# Altium schematic sheet Onboard interfaces.SchDoc
size A4; SheetNumber: 7; SheetTotal: 7
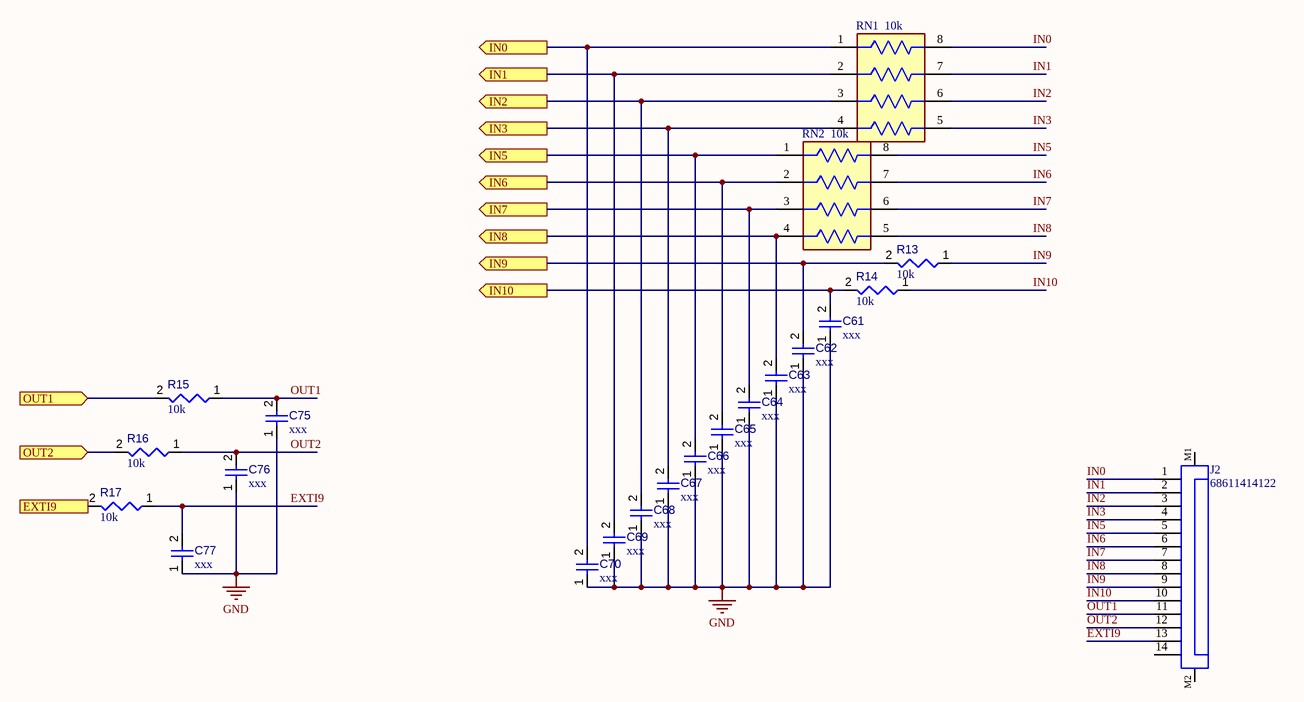
[diagram p0: Onboard interfaces.SchDoc]

## Parts
C61  value xxx  [CAPC0603(1608)100_L]  (hidden comment: Capacitor 470nF +/-20% 25V 0603)
C62  value xxx  [CAPC0603(1608)100_L]  (hidden comment: Capacitor 470nF +/-20% 25V 0603)
C63  value xxx  [CAPC0603(1608)100_L]  (hidden comment: Capacitor 470nF +/-20% 25V 0603)
C64  value xxx  [CAPC0603(1608)100_L]  (hidden comment: Capacitor 470nF +/-20% 25V 0603)
C65  value xxx  [CAPC0603(1608)100_L]  (hidden comment: Capacitor 470nF +/-20% 25V 0603)
C66  value xxx  [CAPC0603(1608)100_L]  (hidden comment: Capacitor 470nF +/-20% 25V 0603)
C67  value xxx  [CAPC0603(1608)100_L]  (hidden comment: Capacitor 470nF +/-20% 25V 0603)
C68  value xxx  [CAPC0603(1608)100_L]  (hidden comment: Capacitor 470nF +/-20% 25V 0603)
C69  value xxx  [CAPC0603(1608)100_L]  (hidden comment: Capacitor 470nF +/-20% 25V 0603)
C70  value xxx  [CAPC0603(1608)100_L]  (hidden comment: Capacitor 470nF +/-20% 25V 0603)
C75  value xxx  [CAPC0603(1608)100_L]  (hidden comment: Capacitor 470nF +/-20% 25V 0603)
C76  value xxx  [CAPC0603(1608)100_L]  (hidden comment: Capacitor 470nF +/-20% 25V 0603)
C77  value xxx  [CAPC0603(1608)100_L]  (hidden comment: Capacitor 470nF +/-20% 25V 0603)
J2  68611414122  [68611414122]
R13  value 10k  [RESC0603(1608)_L]  (hidden comment: 120R3J)
R14  value 10k  [RESC0603(1608)_L]  (hidden comment: 120R3J)
R15  value 10k  [RESC0603(1608)_L]  (hidden comment: 120R3J)
R16  value 10k  [RESC0603(1608)_L]  (hidden comment: 120R3J)
R17  value 10k  [RESC0603(1608)_L]  (hidden comment: 120R3J)
RN1  10k  [FP-YC164-MFG]
RN2  10k  [FP-YC164-MFG]

## Ports
EXTI9 (out), IN0 (out), IN1 (out), IN2 (out), IN3 (out), IN5 (out), IN6 (out), IN7 (out), IN8 (out), IN9 (out), IN10 (out), OUT1 (in), OUT2 (in)

## Nets
GND: C61.1 C62.1 C63.1 C64.1 C65.1 C66.1 C67.1 C68.1 C69.1 C70.1 C75.1 C76.1 C77.1
EXTI9: C77.2 J2.13 R17.1
EXTI9: R17.2 ; port EXTI9  [a separate net that carries the same name]
IN0: C70.2 RN1.1 ; port IN0
IN0: J2.1 RN1.8  [a separate net that carries the same name]
IN1: C69.2 RN1.2 ; port IN1
IN1: J2.2 RN1.7  [a separate net that carries the same name]
IN2: C68.2 RN1.3 ; port IN2
IN2: J2.3 RN1.6  [a separate net that carries the same name]
IN3: C67.2 RN1.4 ; port IN3
IN3: J2.4 RN1.5  [a separate net that carries the same name]
IN5: C66.2 RN2.1 ; port IN5
IN5: J2.5 RN2.8  [a separate net that carries the same name]
IN6: C65.2 RN2.2 ; port IN6
IN6: J2.6 RN2.7  [a separate net that carries the same name]
IN7: C64.2 RN2.3 ; port IN7
IN7: J2.7 RN2.6  [a separate net that carries the same name]
IN8: C63.2 RN2.4 ; port IN8
IN8: J2.8 RN2.5  [a separate net that carries the same name]
IN9: C62.2 R13.2 ; port IN9
IN9: J2.9 R13.1  [a separate net that carries the same name]
IN10: C61.2 R14.2 ; port IN10
IN10: J2.10 R14.1  [a separate net that carries the same name]
OUT1: C75.2 J2.11 R15.1
OUT1: R15.2 ; port OUT1  [a separate net that carries the same name]
OUT2: C76.2 J2.12 R16.1
OUT2: R16.2 ; port OUT2  [a separate net that carries the same name]

Not connected (* = marked no-connect by the designer): J2 14 M1 M2

## Library data of the parts
C61-C70 C75-C77 = CMP-001-00077-3: Chip Capacitor, 470nF +/-20%, 25V, 0603, Thickness 1 mm; Tolerance: 10%; Max Operating Temperature: 85°C; Voltage Rating: 25V; Pins: 2; Case/Package: 0603; Mounting Technology: SMT; Min Operating Temperature: -55°C
J2 = CMP-1502-01474-2: NexarPartId: 8917684; Gender: Male; Current Rating: 1A; Voltage Rating: 125V; Pitch: 1mm; Insulation Resistance: 100MΩ; Actuator Material: Polyphenylene; Contact Resistance: 20mΩ; Number of Contacts: 14; Flammability Rating: UL94 V-0; Width: 2.95mm; Lead Pitch: 1mm; RoHS: Compliant; Housing Material: Polyphenylene; Min Operating Temperature: -25°C; Number of Rows: 1; Contact Material: Bronze, Tin; Contact Plating: Tin; Mount: Surface Mount; Number of Pins: 14; Orientation: Horizontal; Length: 21mm; Termination: Solder; Packaging: Tape and Reel; Operating Supply Voltage: 125V; Max Operating Temperature: 85°C; REACH SVHC: No SVHC; Number of Positions: 14
R13-R17 = CMP-009-00069-2: 120R 0.1W 5% 0603 (1608 Metric)  SMD; Power: 100mW; Mounting Technology: SMT; Tolerance: 5%; Case/Package: 0603; Pins: 2
RN1 RN2 = CMP-03411-000003-1: RES ARRAY 4 RES 10K OHM 1206; Resistance Tolerance: 5%; Power Per Element: 62.5mW; Number of Circuits: 4; Number of Terminals/Pins: 8; Voltage Rating: 50V; Resistance: 10kR; Circuit Type: Isolated; Tolerance: 1%; Temperature Coefficient: 200ppm/°C; Depth: 1.6mm; Termination: SMD/SMT; Technology: THICK FILM; Lead Free: Lead Free; Min Operating Temperature: -55°C; Number of Elements: 4; Series: YC164; Radiation Hardening: No; Length: 0.126inch; Width: 0.063inch; Case Code (Metric): 3216; Number of Pins: 8; Package Quantity: 5000; Number of Contacts: 8; Working Voltage: 50V; Packaging: Tape and Reel; Height: 0.028inch; Mount: Surface Mount; Number of Resistors: 4; Case Code (Imperial): 1206; Size Code: 0603; Terminal Pitch: 0.8mm; Military Standard: Not; Power Dissipation: 62.5mW; Case/Package: 0164; RoHS Compliant: Yes; Max Operating Temperature: 155°C